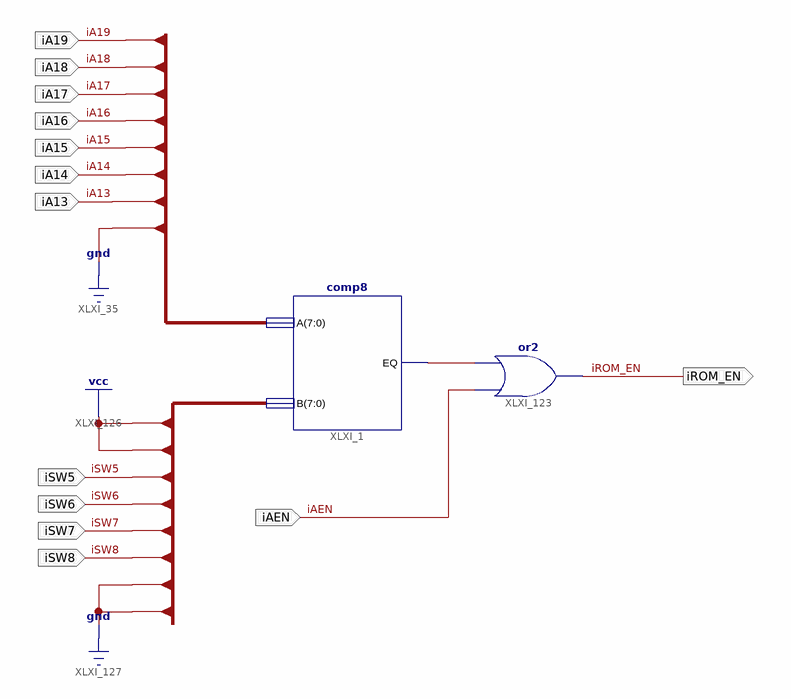
[diagram p0: schematic sheet 1]
// Xilinx ISE schematic ROM_DECODE.sch (xc9500) as structural Verilog: 2 symbols, 13 ports
module ROM_DECODE (
  input  iAEN,
  input  iA19,
  input  iA18,
  input  iA17,
  input  iA16,
  input  iA15,
  input  iA14,
  input  iSW5,
  input  iSW6,
  input  iSW7,
  input  iA13,
  input  iSW8,
  output iROM_EN
);

  wire XLXN_113;
  wire [7:0] XLXN_36, XLXN_135;

  comp8 XLXI_1 (.A(XLXN_36), .B(XLXN_135), .EQ(XLXN_113));
  or XLXI_123 (iROM_EN, iAEN, XLXN_113);
endmodule
